# EAGLE schematic d150_zm1000_socket_rev_a (EAGLE 6.1)
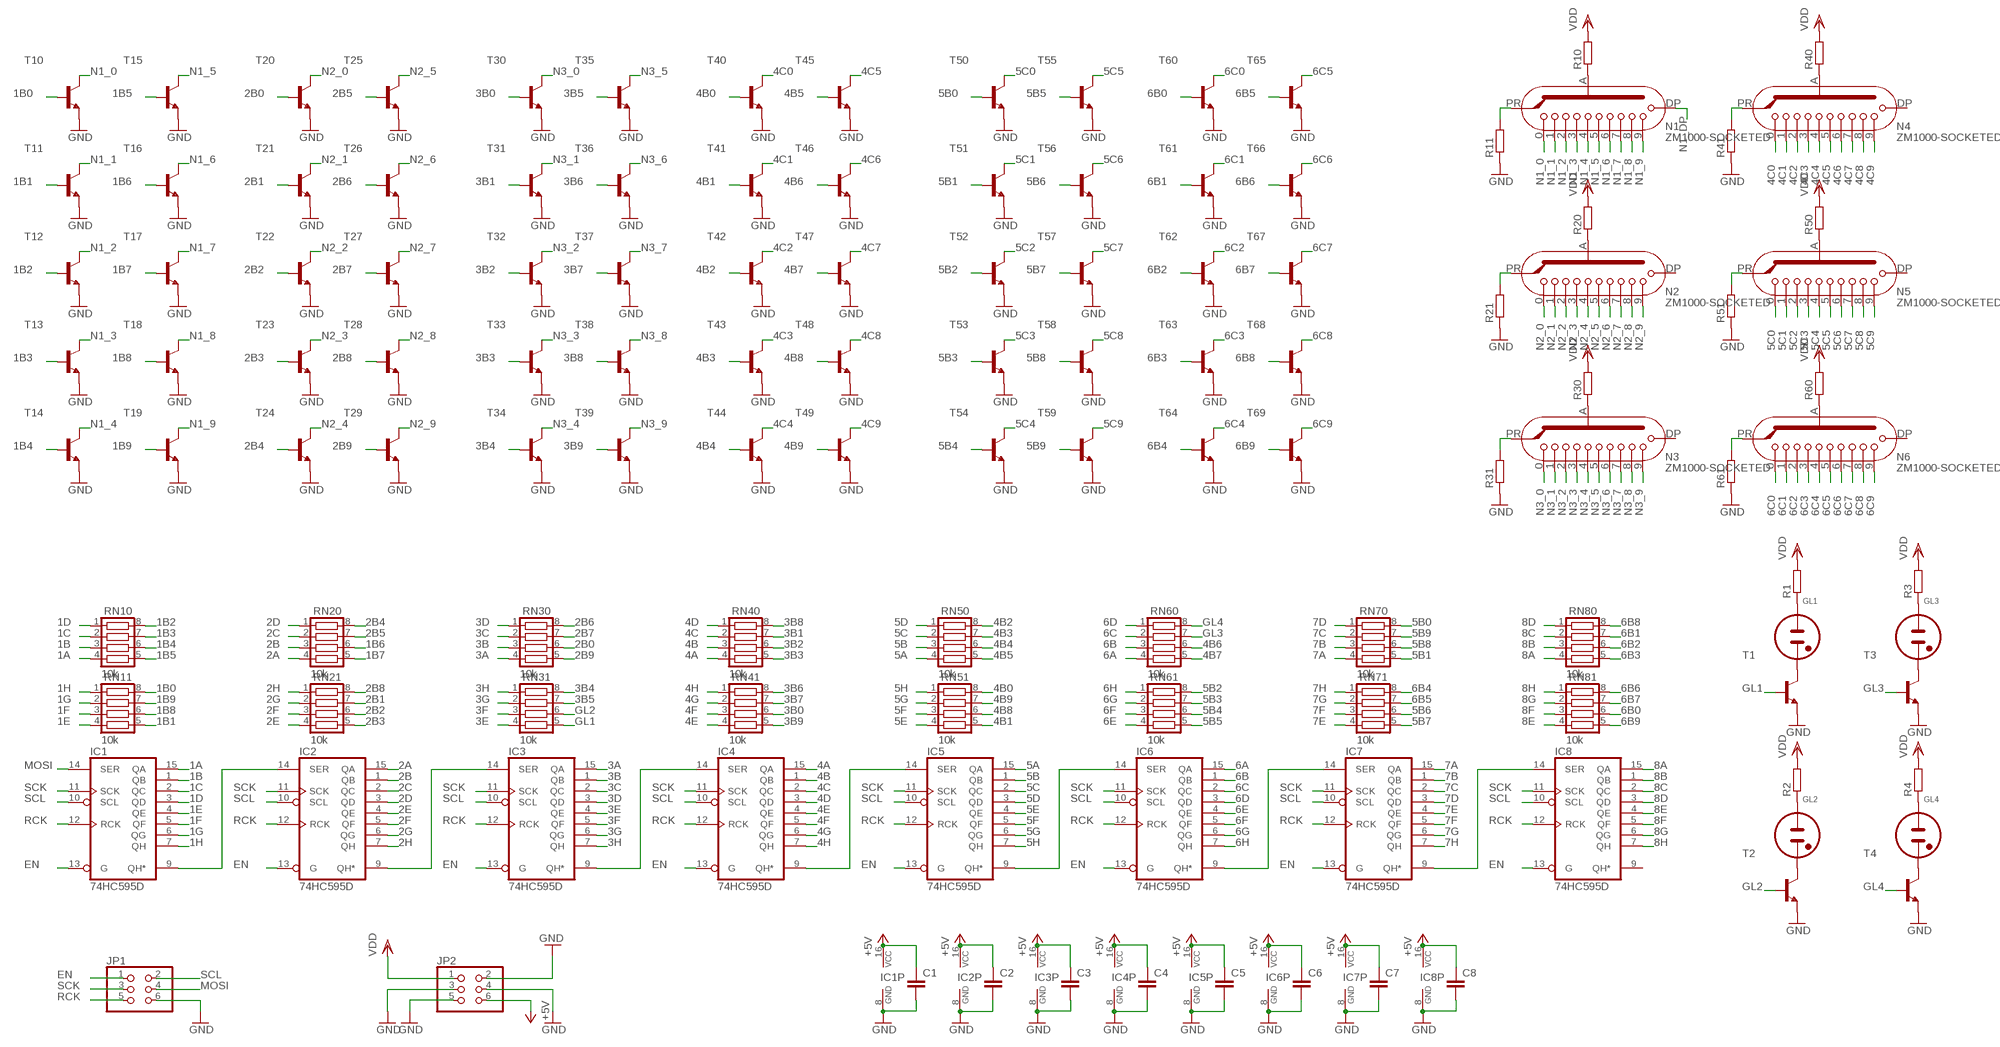
[diagram p0: schematic, sheet 1]

## Parts
C1  C-EUC0603  [C0603]
C2  C-EUC0603  [C0603]
C3  C-EUC0603  [C0603]
C4  C-EUC0603  [C0603]
C5  C-EUC0603  [C0603]
C6  C-EUC0603  [C0603]
C7  C-EUC0603  [C0603]
C8  C-EUC0603  [C0603]
GL1  NE2-NEON-BULB-DRILL  [NE2-NEON-BULB-DRILL]
GL2  NE2-NEON-BULB-DRILL  [NE2-NEON-BULB-DRILL]
GL3  NE2-NEON-BULB-DRILL  [NE2-NEON-BULB-DRILL]
GL4  NE2-NEON-BULB-DRILL  [NE2-NEON-BULB-DRILL]
IC1  74HC595D  [SO16]
IC2  74HC595D  [SO16]
IC3  74HC595D  [SO16]
IC4  74HC595D  [SO16]
IC5  74HC595D  [SO16]
IC6  74HC595D  [SO16]
IC7  74HC595D  [SO16]
IC8  74HC595D  [SO16]
JP1  PINHD-2X3_2.54-SMD  [2X03SMD]
JP2  PINHD-2X3_2.54-SMD  [2X03SMD]
N1  ZM1000-SOCKETED  [ZM1000-SOCKETED]
N2  ZM1000-SOCKETED  [ZM1000-SOCKETED]
N3  ZM1000-SOCKETED  [ZM1000-SOCKETED]
N4  ZM1000-SOCKETED  [ZM1000-SOCKETED]
N5  ZM1000-SOCKETED  [ZM1000-SOCKETED]
N6  ZM1000-SOCKETED  [ZM1000-SOCKETED]
R1  R-EU_R0603  [R0603]
R2  R-EU_R0603  [R0603]
R3  R-EU_R0603  [R0603]
R4  R-EU_R0603  [R0603]
R10  R-EU_R0603  [R0603]
R11  R-EU_R0603  [R0603]
R20  R-EU_R0603  [R0603]
R21  R-EU_R0603  [R0603]
R30  R-EU_R0603  [R0603]
R31  R-EU_R0603  [R0603]
R40  R-EU_R0603  [R0603]
R41  R-EU_R0603  [R0603]
R50  R-EU_R0603  [R0603]
R51  R-EU_R0603  [R0603]
R60  R-EU_R0603  [R0603]
R61  R-EU_R0603  [R0603]
RN10  10k  CTS742C083  [CTS742C083]
RN11  10k  CTS742C083  [CTS742C083]
RN20  10k  CTS742C083  [CTS742C083]
RN21  10k  CTS742C083  [CTS742C083]
RN30  10k  CTS742C083  [CTS742C083]
RN31  10k  CTS742C083  [CTS742C083]
RN40  10k  CTS742C083  [CTS742C083]
RN41  10k  CTS742C083  [CTS742C083]
RN50  10k  CTS742C083  [CTS742C083]
RN51  10k  CTS742C083  [CTS742C083]
RN60  10k  CTS742C083  [CTS742C083]
RN61  10k  CTS742C083  [CTS742C083]
RN70  10k  CTS742C083  [CTS742C083]
RN71  10k  CTS742C083  [CTS742C083]
RN80  10k  CTS742C083  [CTS742C083]
RN81  10k  CTS742C083  [CTS742C083]
T1  SMBTA42  [SOT23]
T2  SMBTA42  [SOT23]
T3  SMBTA42  [SOT23]
T4  SMBTA42  [SOT23]
T10  SMBTA42  [SOT23]
T11  SMBTA42  [SOT23]
T12  SMBTA42  [SOT23]
T13  SMBTA42  [SOT23]
T14  SMBTA42  [SOT23]
T15  SMBTA42  [SOT23]
T16  SMBTA42  [SOT23]
T17  SMBTA42  [SOT23]
T18  SMBTA42  [SOT23]
T19  SMBTA42  [SOT23]
T20  SMBTA42  [SOT23]
T21  SMBTA42  [SOT23]
T22  SMBTA42  [SOT23]
T23  SMBTA42  [SOT23]
T24  SMBTA42  [SOT23]
T25  SMBTA42  [SOT23]
T26  SMBTA42  [SOT23]
T27  SMBTA42  [SOT23]
T28  SMBTA42  [SOT23]
T29  SMBTA42  [SOT23]
T30  SMBTA42  [SOT23]
T31  SMBTA42  [SOT23]
T32  SMBTA42  [SOT23]
T33  SMBTA42  [SOT23]
T34  SMBTA42  [SOT23]
T35  SMBTA42  [SOT23]
T36  SMBTA42  [SOT23]
T37  SMBTA42  [SOT23]
T38  SMBTA42  [SOT23]
T39  SMBTA42  [SOT23]
T40  SMBTA42  [SOT23]
T41  SMBTA42  [SOT23]
T42  SMBTA42  [SOT23]
T43  SMBTA42  [SOT23]
T44  SMBTA42  [SOT23]
T45  SMBTA42  [SOT23]
T46  SMBTA42  [SOT23]
T47  SMBTA42  [SOT23]
T48  SMBTA42  [SOT23]
T49  SMBTA42  [SOT23]
T50  SMBTA42  [SOT23]
T51  SMBTA42  [SOT23]
T52  SMBTA42  [SOT23]
T53  SMBTA42  [SOT23]
T54  SMBTA42  [SOT23]
T55  SMBTA42  [SOT23]
T56  SMBTA42  [SOT23]
T57  SMBTA42  [SOT23]
T58  SMBTA42  [SOT23]
T59  SMBTA42  [SOT23]
T60  SMBTA42  [SOT23]
T61  SMBTA42  [SOT23]
T62  SMBTA42  [SOT23]
T63  SMBTA42  [SOT23]
T64  SMBTA42  [SOT23]
T65  SMBTA42  [SOT23]
T66  SMBTA42  [SOT23]
T67  SMBTA42  [SOT23]
T68  SMBTA42  [SOT23]
T69  SMBTA42  [SOT23]

## Nets
1A: IC1.15(QA) RN10.4
1B: IC1.1(QB) RN10.3
1B0: RN11.8 T10.1(B)
1B1: RN11.5 T11.1(B)
1B2: RN10.8 T12.1(B)
1B3: RN10.7 T13.1(B)
1B4: RN10.6 T14.1(B)
1B5: RN10.5 T15.1(B)
1B6: RN20.6 T16.1(B)
1B7: RN20.5 T17.1(B)
1B8: RN11.6 T18.1(B)
1B9: RN11.7 T19.1(B)
1C: IC1.2(QC) RN10.2
1D: IC1.3(QD) RN10.1
1E: IC1.4(QE) RN11.4
1F: IC1.5(QF) RN11.3
1G: IC1.6(QG) RN11.2
1H: IC1.7(QH) RN11.1
2A: IC2.15(QA) RN20.4
2B: IC2.1(QB) RN20.3
2B0: RN30.6 T20.1(B)
2B1: RN21.7 T21.1(B)
2B2: RN21.6 T22.1(B)
2B3: RN21.5 T23.1(B)
2B4: RN20.8 T24.1(B)
2B5: RN20.7 T25.1(B)
2B6: RN30.8 T26.1(B)
2B7: RN30.7 T27.1(B)
2B8: RN21.8 T28.1(B)
2B9: RN30.5 T29.1(B)
2C: IC2.2(QC) RN20.2
2D: IC2.3(QD) RN20.1
2E: IC2.4(QE) RN21.4
2F: IC2.5(QF) RN21.3
2G: IC2.6(QG) RN21.2
2H: IC2.7(QH) RN21.1
3A: IC3.15(QA) RN30.4
3B: IC3.1(QB) RN30.3
3B0: RN41.6 T30.1(B)
3B1: RN40.7 T31.1(B)
3B2: RN40.6 T32.1(B)
3B3: RN40.5 T33.1(B)
3B4: RN31.8 T34.1(B)
3B5: RN31.7 T35.1(B)
3B6: RN41.8 T36.1(B)
3B7: RN41.7 T37.1(B)
3B8: RN40.8 T38.1(B)
3B9: RN41.5 T39.1(B)
3C: IC3.2(QC) RN30.2
3D: IC3.3(QD) RN30.1
3E: IC3.4(QE) RN31.4
3F: IC3.5(QF) RN31.3
3G: IC3.6(QG) RN31.2
3H: IC3.7(QH) RN31.1
4A: IC4.15(QA) RN40.4
4B: IC4.1(QB) RN40.3
4B0: RN51.8 T40.1(B)
4B1: RN51.5 T41.1(B)
4B2: RN50.8 T42.1(B)
4B3: RN50.7 T43.1(B)
4B4: RN50.6 T44.1(B)
4B5: RN50.5 T45.1(B)
4B6: RN60.6 T46.1(B)
4B7: RN60.5 T47.1(B)
4B8: RN51.6 T48.1(B)
4B9: RN51.7 T49.1(B)
4C: IC4.2(QC) RN40.2
4C0: N4.K0 T40.3(C)
4C1: N4.K1 T41.3(C)
4C2: N4.K2 T42.3(C)
4C3: N4.K3 T43.3(C)
4C4: N4.K4 T44.3(C)
4C5: N4.K5 T45.3(C)
4C6: N4.K6 T46.3(C)
4C7: N4.K7 T47.3(C)
4C8: N4.K8 T48.3(C)
4C9: N4.K9 T49.3(C)
4D: IC4.3(QD) RN40.1
4E: IC4.4(QE) RN41.4
4F: IC4.5(QF) RN41.3
4G: IC4.6(QG) RN41.2
4H: IC4.7(QH) RN41.1
5A: IC5.15(QA) RN50.4
5B: IC5.1(QB) RN50.3
5B0: RN70.8 T50.1(B)
5B1: RN70.5 T51.1(B)
5B2: RN61.8 T52.1(B)
5B3: RN61.7 T53.1(B)
5B4: RN61.6 T54.1(B)
5B5: RN61.5 T55.1(B)
5B6: RN71.6 T56.1(B)
5B7: RN71.5 T57.1(B)
5B8: RN70.6 T58.1(B)
5B9: RN70.7 T59.1(B)
5C: IC5.2(QC) RN50.2
5C0: N5.K0 T50.3(C)
5C1: N5.K1 T51.3(C)
5C2: N5.K2 T52.3(C)
5C3: N5.K3 T53.3(C)
5C4: N5.K4 T54.3(C)
5C5: N5.K5 T55.3(C)
5C6: N5.K6 T56.3(C)
5C7: N5.K7 T57.3(C)
5C8: N5.K8 T58.3(C)
5C9: N5.K9 T59.3(C)
5D: IC5.3(QD) RN50.1
5E: IC5.4(QE) RN51.4
5F: IC5.5(QF) RN51.3
5G: IC5.6(QG) RN51.2
5H: IC5.7(QH) RN51.1
6A: IC6.15(QA) RN60.4
6B: IC6.1(QB) RN60.3
6B0: RN81.6 T60.1(B)
6B1: RN80.7 T61.1(B)
6B2: RN80.6 T62.1(B)
6B3: RN80.5 T63.1(B)
6B4: RN71.8 T64.1(B)
6B5: RN71.7 T65.1(B)
6B6: RN81.8 T66.1(B)
6B7: RN81.7 T67.1(B)
6B8: RN80.8 T68.1(B)
6B9: RN81.5 T69.1(B)
6C: IC6.2(QC) RN60.2
6C0: N6.K0 T60.3(C)
6C1: N6.K1 T61.3(C)
6C2: N6.K2 T62.3(C)
6C3: N6.K3 T63.3(C)
6C4: N6.K4 T64.3(C)
6C5: N6.K5 T65.3(C)
6C6: N6.K6 T66.3(C)
6C7: N6.K7 T67.3(C)
6C8: N6.K8 T68.3(C)
6C9: N6.K9 T69.3(C)
6D: IC6.3(QD) RN60.1
6E: IC6.4(QE) RN61.4
6F: IC6.5(QF) RN61.3
6G: IC6.6(QG) RN61.2
6H: IC6.7(QH) RN61.1
7A: IC7.15(QA) RN70.4
7B: IC7.1(QB) RN70.3
7C: IC7.2(QC) RN70.2
7D: IC7.3(QD) RN70.1
7E: IC7.4(QE) RN71.4
7F: IC7.5(QF) RN71.3
7G: IC7.6(QG) RN71.2
7H: IC7.7(QH) RN71.1
8A: IC8.15(QA) RN80.4
8B: IC8.1(QB) RN80.3
8C: IC8.2(QC) RN80.2
8D: IC8.3(QD) RN80.1
8E: IC8.4(QE) RN81.4
8F: IC8.5(QF) RN81.3
8G: IC8.6(QG) RN81.2
8H: IC8.7(QH) RN81.1
+5V: C1.1 C2.1 C3.1 C4.1 C5.1 C6.1 C7.1 C8.1 IC1.16(VCC) IC2.16(VCC) IC3.16(VCC) IC4.16(VCC) IC5.16(VCC) IC6.16(VCC) IC7.16(VCC) IC8.16(VCC) JP2.6
EN: IC1.13(G) IC2.13(G) IC3.13(G) IC4.13(G) IC5.13(G) IC6.13(G) IC7.13(G) IC8.13(G) JP1.1
GL1: RN31.5 T1.1(B)
GL2: RN31.6 T2.1(B)
GL3: RN60.7 T3.1(B)
GL4: RN60.8 T4.1(B)
GND: C1.2 C2.2 C3.2 C4.2 C5.2 C6.2 C7.2 C8.2 IC1.8(GND) IC2.8(GND) IC3.8(GND) IC4.8(GND) IC5.8(GND) IC6.8(GND) IC7.8(GND) IC8.8(GND) JP1.6 JP2.2 JP2.3 JP2.4 JP2.5 R11.1 R21.1 R31.1 R41.1 R51.1 R61.1 T1.2(E) T2.2(E) T3.2(E) T4.2(E) T10.2(E) T11.2(E) T12.2(E) T13.2(E) T14.2(E) T15.2(E) T16.2(E) T17.2(E) T18.2(E) T19.2(E) T20.2(E) T21.2(E) T22.2(E) T23.2(E) T24.2(E) T25.2(E) T26.2(E) T27.2(E) T28.2(E) T29.2(E) T30.2(E) T31.2(E) T32.2(E) T33.2(E) T34.2(E) T35.2(E) T36.2(E) T37.2(E) T38.2(E) T39.2(E) T40.2(E) T41.2(E) T42.2(E) T43.2(E) T44.2(E) T45.2(E) T46.2(E) T47.2(E) T48.2(E) T49.2(E) T50.2(E) T51.2(E) T52.2(E) T53.2(E) T54.2(E) T55.2(E) T56.2(E) T57.2(E) T58.2(E) T59.2(E) T60.2(E) T61.2(E) T62.2(E) T63.2(E) T64.2(E) T65.2(E) T66.2(E) T67.2(E) T68.2(E) T69.2(E)
MOSI: IC1.14(SER) JP1.4
N1_0: N1.K0 T10.3(C)
N1_1: N1.K1 T11.3(C)
N1_2: N1.K2 T12.3(C)
N1_3: N1.K3 T13.3(C)
N1_4: N1.K4 T14.3(C)
N1_5: N1.K5 T15.3(C)
N1_6: N1.K6 T16.3(C)
N1_7: N1.K7 T17.3(C)
N1_8: N1.K8 T18.3(C)
N1_9: N1.K9 T19.3(C)
N1_DP: N1.KDP(DP)
N1_PR: N1.PR R11.2
N2_0: N2.K0 T20.3(C)
N2_1: N2.K1 T21.3(C)
N2_2: N2.K2 T22.3(C)
N2_3: N2.K3 T23.3(C)
N2_4: N2.K4 T24.3(C)
N2_5: N2.K5 T25.3(C)
N2_6: N2.K6 T26.3(C)
N2_7: N2.K7 T27.3(C)
N2_8: N2.K8 T28.3(C)
N2_9: N2.K9 T29.3(C)
N3_0: N3.K0 T30.3(C)
N3_1: N3.K1 T31.3(C)
N3_2: N3.K2 T32.3(C)
N3_3: N3.K3 T33.3(C)
N3_4: N3.K4 T34.3(C)
N3_5: N3.K5 T35.3(C)
N3_6: N3.K6 T36.3(C)
N3_7: N3.K7 T37.3(C)
N3_8: N3.K8 T38.3(C)
N3_9: N3.K9 T39.3(C)
N$1: GL2.1(A) R2.1
N$2: GL3.1(A) R3.1
N$3: GL4.1(A) R4.1
N$4: N1.A1(A) N1.A2(A) R10.1
N$5: GL2.2(A1) T2.3(C)
N$6: GL1.2(A1) T1.3(C)
N$7: GL4.2(A1) T4.3(C)
N$8: GL3.2(A1) T3.3(C)
N$9: N2.A1(A) N2.A2(A) R20.1
N$10: IC1.9(QH*) IC2.14(SER)
N$11: IC2.9(QH*) IC3.14(SER)
N$12: IC3.9(QH*) IC4.14(SER)
N$13: N3.A1(A) N3.A2(A) R30.1
N$14: N4.A1(A) N4.A2(A) R40.1
N$15: N5.A1(A) N5.A2(A) R50.1
N$16: IC4.9(QH*) IC5.14(SER)
N$17: N6.A1(A) N6.A2(A) R60.1
N$18: IC5.9(QH*) IC6.14(SER)
N$19: IC6.9(QH*) IC7.14(SER)
N$20: IC7.9(QH*) IC8.14(SER)
N$21: GL1.1(A) R1.1
N$25: N6.PR R61.2
N$26: N3.PR R31.2
N$27: N2.PR R21.2
N$28: N5.PR R51.2
N$29: N4.PR R41.2
RCK: IC1.12(RCK) IC2.12(RCK) IC3.12(RCK) IC4.12(RCK) IC5.12(RCK) IC6.12(RCK) IC7.12(RCK) IC8.12(RCK) JP1.5
SCK: IC1.11(SCK) IC2.11(SCK) IC3.11(SCK) IC4.11(SCK) IC5.11(SCK) IC6.11(SCK) IC7.11(SCK) IC8.11(SCK) JP1.3
SCL: IC1.10(SCL) IC2.10(SCL) IC3.10(SCL) IC4.10(SCL) IC5.10(SCL) IC6.10(SCL) IC7.10(SCL) IC8.10(SCL) JP1.2
VDD: JP2.1 R1.2 R2.2 R3.2 R4.2 R10.2 R20.2 R30.2 R40.2 R50.2 R60.2
Unconnected: IC8.9(QH*) N2.KDP(DP) N3.KDP(DP) N4.KDP(DP) N5.KDP(DP) N6.KDP(DP)

## Library data of the parts
C1-C8 = rcl:C-EU: CAPACITOR, European symbol
GL1-GL4 = nixie_tube:NE2-NEON-BULB: Neon indicator (wire connection)
IC1-IC8 = 74xx-eu:74*595: 8-bit SHIFT REGISTER, output latch
JP1 JP2 = con-pinhead:PINHD-2X3: PIN HEADER
N1-N6 = nixietubes-western:ZM1000: Cold cathode, neon filled, side viewing indicator tubes with long life expectancy. The ZM1000R is coated with a red filter to improve the contrast of display. These tubes incorporate a decimal point and are fitted with a pin base to suid the standard grid (2.54mm). A primer allows ionisation without delay in strobe type or blanking applications. Numeral height: 14 mm Minimum distance between mounting centres: 19 mm Numerals: 1 2 3 4 5 6 7 8 9 0 Decimal point: to the left of the numerals Cathode current, average: 2.5 mA, maximum peak: 12mA Minimum supply voltage: 170 V
R1-R4 R10 R11 R20 R21 R30 R31 R40 R41 R50 R51 R60 R61 = rcl:R-EU_: RESISTOR, European symbol
RN10 RN11 RN20 RN21 RN30 RN31 RN40 RN41 RN50 RN51 RN60 RN61 RN70 RN71 RN80 RN81 = resistor-net:CTS742C083: Chip Resistor Array 4 Single Resistor Source: http://www.ctscorp.com/components/Datasheets/CTSChipArrayDs.pdf; OC_FARNELL: unknown; OC_NEWARK: unknown
T1-T4 T10-T69 = transistor-hv:SMBTA42